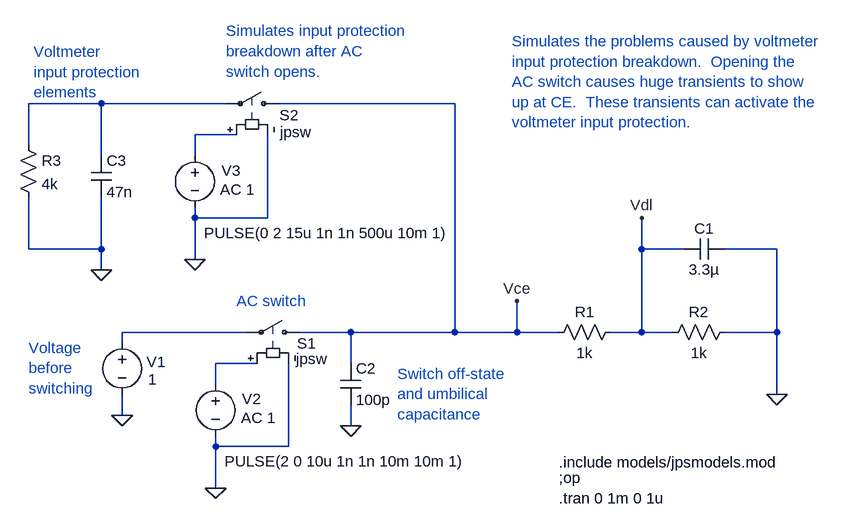
[diagram p0: schematic acswitch_bustre.asc]
acswitch_bustre.asc, the LTspice schematic file:
Version 4
SHEET 1 880 680
WIRE -496 -256 -608 -256
WIRE -304 -256 -496 -256
WIRE 48 -256 -224 -256
WIRE -288 -208 -352 -208
WIRE -608 -192 -608 -256
WIRE -496 -176 -496 -256
WIRE -352 -176 -352 -208
WIRE -352 -80 -352 -96
WIRE -240 -80 -240 -208
WIRE -240 -80 -352 -80
WIRE -608 -32 -608 -112
WIRE -496 -32 -496 -112
WIRE -496 -32 -608 -32
WIRE 336 -32 336 -80
WIRE 400 -32 336 -32
WIRE 544 -32 464 -32
WIRE -352 -16 -352 -80
WIRE -496 0 -496 -32
WIRE -272 96 -464 96
WIRE -112 96 -192 96
WIRE 48 96 48 -256
WIRE 48 96 -112 96
WIRE 144 96 144 48
WIRE 144 96 48 96
WIRE 208 96 144 96
WIRE 336 96 336 -32
WIRE 336 96 288 96
WIRE 384 96 336 96
WIRE 544 96 544 -32
WIRE 544 96 464 96
WIRE -464 112 -464 96
WIRE -256 144 -320 144
WIRE -112 144 -112 96
WIRE -320 176 -320 144
WIRE 544 192 544 96
WIRE -464 224 -464 192
WIRE -112 240 -112 208
WIRE -320 272 -320 256
WIRE -208 272 -208 144
WIRE -208 272 -320 272
WIRE -320 336 -320 272
FLAG -320 336 0
FLAG -464 224 0
FLAG 544 192 0
FLAG -112 240 0
FLAG 144 48 Vce
FLAG 336 -80 Vdl
FLAG -352 -16 0
FLAG -496 0 0
SYMBOL sw -176 96 M270
WINDOW 0 -17 19 VLeft 2
WINDOW 3 -41 20 VLeft 2
SYMATTR InstName S1
SYMATTR Value jpsw
SYMBOL voltage -320 160 R0
WINDOW 123 39 68 Left 2
WINDOW 39 0 0 Left 2
WINDOW 0 41 39 Left 2
WINDOW 3 14 135 Left 2
SYMATTR Value2 AC 1
SYMATTR InstName V2
SYMATTR Value PULSE(2 0 10u 1n 1n 10m 10m 1)
SYMBOL voltage -464 96 R0
WINDOW 123 0 0 Left 2
WINDOW 39 0 0 Left 2
WINDOW 0 38 46 Left 2
WINDOW 3 40 73 Left 2
SYMATTR InstName V1
SYMATTR Value 1
SYMBOL res 192 112 R270
WINDOW 0 32 56 VTop 2
WINDOW 3 0 56 VBottom 2
SYMATTR InstName R1
SYMATTR Value 1k
SYMBOL res 368 112 R270
WINDOW 0 32 56 VTop 2
WINDOW 3 0 56 VBottom 2
SYMATTR InstName R2
SYMATTR Value 1k
SYMBOL cap 400 -16 R270
WINDOW 0 32 32 VTop 2
WINDOW 3 0 32 VBottom 2
SYMATTR InstName C1
SYMATTR Value 3.3µ
SYMBOL cap -128 144 R0
SYMATTR InstName C2
SYMATTR Value 100p
SYMBOL sw -208 -256 M270
WINDOW 0 -18 14 VLeft 2
WINDOW 3 -44 13 VLeft 2
SYMATTR InstName S2
SYMATTR Value jpsw
SYMBOL voltage -352 -192 R0
WINDOW 123 39 68 Left 2
WINDOW 39 0 0 Left 2
WINDOW 0 41 39 Left 2
WINDOW 3 14 135 Left 2
SYMATTR Value2 AC 1
SYMATTR InstName V3
SYMATTR Value PULSE(0 2 15u 1n 1n 500u 10m 1)
SYMBOL cap -512 -176 R0
SYMATTR InstName C3
SYMATTR Value 47n
SYMBOL res -624 -208 R0
SYMATTR InstName R3
SYMATTR Value 4k
TEXT 208 320 Left 2 !;op
TEXT 208 296 Left 2 !.include models/jpsmodels.mod
TEXT 208 352 Left 2 !.tran 0 1m 0 1u
TEXT -608 120 Left 2 ;Voltage\nbefore\nswitching
TEXT -288 48 Left 2 ;AC switch
TEXT -40 160 Left 2 ;Switch off-state\nand umbilical\ncapacitance
TEXT -304 -368 Left 2 ;Simulates input protection\nbreakdown after AC\nswitch opens.
TEXT -600 -336 Left 2 ;Voltmeter\ninput protection\nelements
TEXT 136 -352 Left 2 ;Simulates the problems caused by voltmeter\ninput protection breakdown.  Opening the\nAC switch causes huge transients to show\nup at CE.  These transients can activate the\nvoltmeter input protection.

The netlist it stands for:
* acswitch_bustre.asc
S1 Vce N003 N004 0 jpsw
V2 N004 0 PULSE(2 0 10u 1n 1n 10m 10m 1) AC 1
V1 N003 0 1
R1 Vce Vdl 1k
R2 Vdl 0 1k
C1 Vdl 0 3.3µ
C2 Vce 0 100p
S2 Vce N001 N002 0 jpsw
V3 N002 0 PULSE(0 2 15u 1n 1n 500u 10m 1) AC 1
C3 N001 0 47n
R3 N001 0 4k
;op
.include models/jpsmodels.mod
.tran 0 1m 0 1u
* Voltage
* before
* switching
* AC switch
* Switch off-state
* and umbilical
* capacitance
* Simulates input protection
* breakdown after AC
* switch opens.
* Voltmeter
* input protection
* elements
* Simulates the problems caused by voltmeter
* input protection breakdown.  Opening the
* AC switch causes huge transients to show
* up at CE.  These transients can activate the
* voltmeter input protection.
.backanno
.end

* Results of the author's LTspice run, read from the files saved beside the schematic
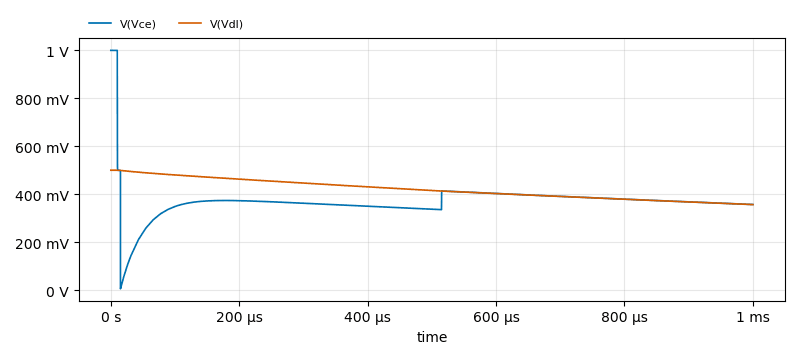
[diagram p1: Transient Analysis of acswitch_bustre.asc, plotted from the saved traces]
* Transient Analysis, 1 run:
*   V(Vce): min 5.488 mV, max 999.5 mV, average 367.9 mV, rms 376.9 mV, last 356.9 mV
*   V(Vdl): min 356.6 mV, max 499.7 mV, average 420.2 mV, rms 422.2 mV, last 356.6 mV